# Altium schematic sheet SHIELD-uSD-MIKROE-PMOD.SchDoc
size A3; CheckedBy: José Ogando; Engineer: Eduardo Teofilo; Revision: A2; SheetNumber: 5; SheetTotal: 8
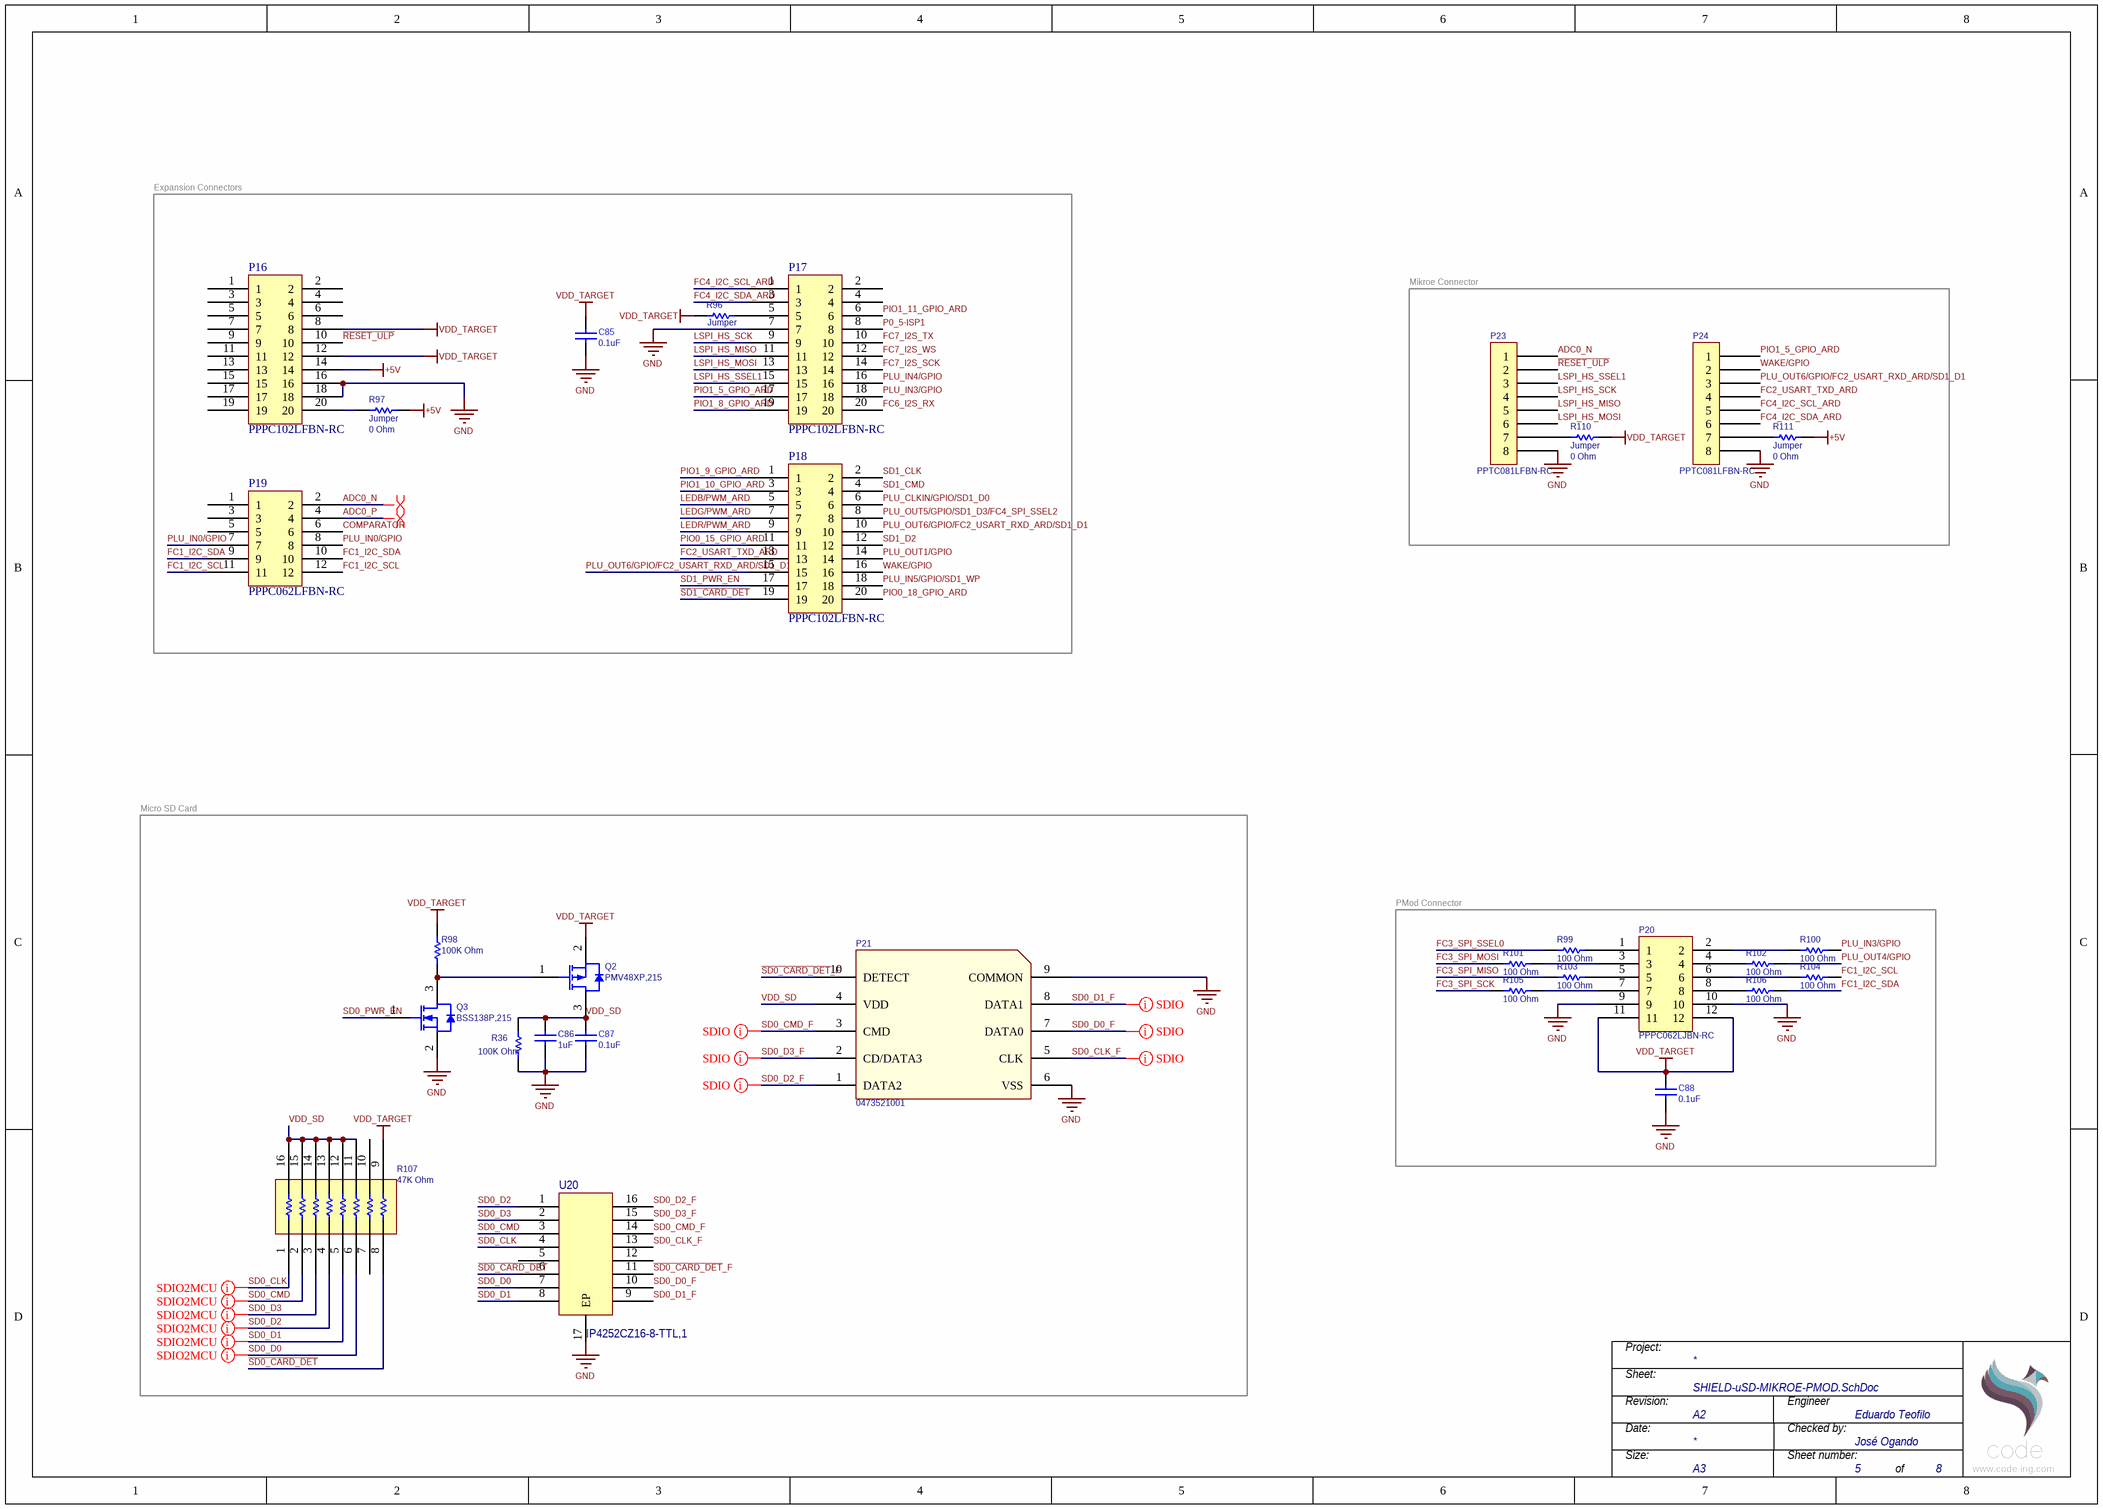
[diagram p0: SHIELD-uSD-MIKROE-PMOD.SchDoc]

## Parts
C85  value 0.1uF  [CAPC1005]  (hidden comment: CC0402KRX7R7BB104)
C86  value 1uF  [CAPC0402(1005)60_L]  (hidden comment: CAP 1uF 10V 0402(1005))
C87  value 0.1uF  [CAPC1005]  (hidden comment: CC0402KRX7R7BB104)
C88  value 0.1uF  [CAPC1005]  (hidden comment: CC0402KRX7R7BB104)
P16  PPPC102LFBN-RC  [PPPC102LFBN-RC]
P17  PPPC102LFBN-RC  [PPPC102LFBN-RC]
P18  PPPC102LFBN-RC  [PPPC102LFBN-RC]
P19  PPPC062LFBN-RC  [PPPC062LFBN-RC]
P20  PPPC062LJBN-RC  [PPPC062LJBN-RC]
P21  0473521001  [0473521001]
P23  PPTC081LFBN-RC  [Header 8x1]
P24  PPTC081LFBN-RC  [Header 8x1]
Q2  PMV48XP,215  [NXP-SOT23_M]
Q3  BSS138P,215  [NXP-SOT23_N]
R36  value 100K Ohm  [RESC1005X40X25LL05T05]  (hidden comment: ERJ-2RKF1003X)
R96  Jumper  [RESC0402(1005)_L]
R97  Jumper  value 0 Ohm  [RESC0402(1005)_L]
R98  value 100K Ohm  [RESC1005X40X25LL05T05]  (hidden comment: ERJ-2RKF1003X)
R99  value 100 Ohm  [RESC0402(1005)_L]  (hidden comment: 100R 5% 0402(1005))
R100  value 100 Ohm  [RESC0402(1005)_L]  (hidden comment: 100R 5% 0402(1005))
R101  value 100 Ohm  [RESC0402(1005)_L]  (hidden comment: 100R 5% 0402(1005))
R102  value 100 Ohm  [RESC0402(1005)_L]  (hidden comment: 100R 5% 0402(1005))
R103  value 100 Ohm  [RESC0402(1005)_L]  (hidden comment: 100R 5% 0402(1005))
R104  value 100 Ohm  [RESC0402(1005)_L]  (hidden comment: 100R 5% 0402(1005))
R105  value 100 Ohm  [RESC0402(1005)_L]  (hidden comment: 100R 5% 0402(1005))
R106  value 100 Ohm  [RESC0402(1005)_L]  (hidden comment: 100R 5% 0402(1005))
R107  value 47K Ohm  [EXB-2HV473JV]  (hidden comment: EXB-2HV473JV)
R110  Jumper  value 0 Ohm  [RESC0402(1005)_L]
R111  Jumper  value 0 Ohm  [RESC0402(1005)_L]
U20  IP4252CZ16-8-TTL,1  [HUSON16]

## Blocks framed on the sheet
Expansion Connectors: C85 P16-P19 R96 R97
Mikroe Connector: P23 P24 R110 R111
Micro SD Card: C86 C87 P21 Q2 Q3 R36 R98 R107 U20
PMod Connector: C88 P20 R99-R106

## Nets
+5V: P16.14 R97.1 R111.1
GND: C85.2 C86.1 C87.2 C88.2 P16.16 P16.18 P17.7 P20.9 P20.10 P21.6(VSS) P21.9(COMMON) P23.8 P24.8 Q3.2(S) R36.1 U20.17(EP)
VDD_TARGET: C85.1 C88.1 P16.8 P16.12 P20.11 P20.12 Q2.2(S) R96.2 R98.2 R107.9 R110.1
ADC0_N: P19.2 P23.1
ADC0_P: P19.4
COMPARATOR: P19.6
FC1_I2C_SCL: P19.11 P19.12 R104.2
FC1_I2C_SDA: P19.9 P19.10 R106.2
FC2_USART_TXD_ARD: P18.13 P24.4
FC3_SPI_MISO: R103.1
FC3_SPI_MOSI: R101.1
FC3_SPI_SCK: R105.1
FC3_SPI_SSEL0: R99.1
FC4_I2C_SCL_ARD: P17.1 P24.5
FC4_I2C_SDA_ARD: P17.3 P24.6
FC6_I2S_RX: P17.20
FC7_I2S_SCK: P17.14
FC7_I2S_TX: P17.10
FC7_I2S_WS: P17.12
LEDB/PWM_ARD: P18.5
LEDG/PWM_ARD: P18.7
LEDR/PWM_ARD: P18.9
LSPI_HS_MISO: P17.11 P23.5
LSPI_HS_MOSI: P17.13 P23.6
LSPI_HS_SCK: P17.9 P23.4
LSPI_HS_SSEL1: P17.15 P23.3
P0_5-ISP1: P17.8
PIO0_15_GPIO_ARD: P18.11
PIO0_18_GPIO_ARD: P18.20
PIO1_5_GPIO_ARD: P17.17 P24.1
PIO1_8_GPIO_ARD: P17.19
PIO1_9_GPIO_ARD: P18.1
PIO1_10_GPIO_ARD: P18.3
PIO1_11_GPIO_ARD: P17.6
PLU_CLKIN/GPIO/SD1_D0: P18.6
PLU_IN0/GPIO: P19.7 P19.8
PLU_IN3/GPIO: P17.18 R100.2
PLU_IN4/GPIO: P17.16
PLU_IN5/GPIO/SD1_WP: P18.18
PLU_OUT1/GPIO: P18.14
PLU_OUT4/GPIO: R102.2
PLU_OUT5/GPIO/SD1_D3/FC4_SPI_SSEL2: P18.8
PLU_OUT6/GPIO/FC2_USART_RXD_ARD/SD1_D1: P18.10 P18.15 P24.3
~{RESET_ULP}: P16.10 P23.2
~{SD0_CARD_DET}: R107.8 U20.6
~{SD0_CARD_DET}_F: P21.10(DETECT) U20.11
~{SD1_CARD_DET}: P18.19
SD0_CLK: R107.1 U20.4
SD0_CLK_F: P21.5(CLK) U20.13
SD0_CMD: R107.2 U20.3
SD0_CMD_F: P21.3(CMD) U20.14
SD0_D0: R107.6 U20.7
SD0_D0_F: P21.7(DATA0) U20.10
SD0_D1: R107.5 U20.8
SD0_D1_F: P21.8(DATA1) U20.9
SD0_D2: R107.4 U20.1
SD0_D2_F: P21.1(DATA2) U20.16
SD0_D3: R107.3 U20.2
SD0_D3_F: P21.2(CD/DATA3) U20.15
SD0_PWR_EN: Q3.1(G)
SD1_CLK: P18.2
SD1_CMD: P18.4
SD1_D2: P18.12
SD1_PWR_EN: P18.17
VDD_SD: C86.2 C87.1 P21.4(VDD) Q2.3(D) R36.2 R107.11 R107.12 R107.13 R107.14 R107.15 R107.16
WAKE/GPIO: P18.16 P24.2
NetP16_20: P16.20 R97.2
NetP17_5: P17.5 R96.1
NetP20_1: P20.1 R99.2
NetP20_2: P20.2 R100.1
NetP20_3: P20.3 R101.2
NetP20_4: P20.4 R102.1
NetP20_5: P20.5 R103.2
NetP20_6: P20.6 R104.1
NetP20_7: P20.7 R105.2
NetP20_8: P20.8 R106.1
NetP23_7: P23.7 R110.2
NetP24_7: P24.7 R111.2
NetQ2_1: Q2.1(G) Q3.3(D) R98.1

Not connected (* = marked no-connect by the designer): P16 1 2 3 4 5 6 7 9 11 13 15 17 19; P17 2 4; P19 1 3 5; R107 7 10; U20 5 12

## Layout directives
net class SDIO: SD0_CLK_F, SD0_CMD_F, SD0_D0_F, SD0_D1_F, SD0_D2_F, SD0_D3_F
net class SDIO2MCU: SD0_CLK, SD0_CMD, SD0_D0, SD0_D1, SD0_D2, SD0_D3
differential pair: ADC0_N, ADC0_P

## Notes on the sheet
- Project:
- Sheet:
- Revision:
- Date:
- Size:
- Sheet number:
- Engineer
- Checked by:
- A3
- of
- www.code-ing.com

## Library data of the parts
C85 C87 C88 = CMP-0001-00074-1: Capacitor, Yageo, Ceramic, 0.1uF 10% 16V 0402 (1005) X7R; Polarity: Non-Polarized; ClassName: Board Template Device; Rated Voltage: 16 V; Status: Production; Tolerance: 10 %; Mounting Technology: Surface Mount; Technology: Ceramic; Category: Capacitor; Dielectric: X7R; Publisher: Altium
C86 = CMP-1034-02118-1: CAP 1uF 10V -20% to +80% 0402 (1005 Metric) Thickness 0.6mm SMD; Case-EIA: 0402; Case-Metric: 1005; Tolerance: -20% to +80%; Max Thickness: 0.6 mm; Rated Voltage: 10 V; Technology: SMT
P16-P18 = PPPC102LFBN-RC: CONN HEADER FMAL 20PS.1" DL GOLD; Manufacturer: Sullins Connector Solutions; Manufacturer Part #: PPPC102LFBN-RC; Created by: jvelasquez; Creation date: 05-Apr-2018; Modified by: *; Indications: *; Value: *
P19 = PPPC062LFBN-RC: CONN HEADER FMAL 12PS.1" DL GOLD; Manufacturer: Sullins Connector Solutions; Manufacturer Part #: PPPC062LFBN-RC; Created by: jvelasquez; Creation date: 05-Apr-2018; Modified by: *; Indications: *; Value: *
P20 = PPPC062LJBN-RC: CONN FEMALE 12POSDL .1" R/A GOLD; Manufacturer: Sullins Connector Solutions; Manufacturer Part #: PPPC062LJBN-RC; Created by: eteofilo; Creation date: 17-Apr-2018; Modified by: *; Value: *
P21 = 0473521001: CONN MICRO SD CARD PUSH-PUSH R/A; Manufacturer: Molex Inc; Manufacturer part #: 0473521001; Indications: *; Created by: eteofilo; Creation date: 17-Apr-2018; Value: *; Modified by: *
P23 P24 = PPTC081LFBN-RC: CONN HEADER FEMALE 8POS .1" TIN; Manufacturer: Sullins Connector Solutions; Manufacturer Part #: PPTC081LFBN-RC; Created by: eteofilo; Creation Date: 10-May-2018; Modified by: *; Value: *; Indicattions: *
Q2 = CMP-1258-00160-1: P-Channel Trench MOSFET, -20 V, -3.5 A, -55 to 150 degC, 3-Pin SOT23, Tape and Reel; Manufacturer: NXP Semiconductors; VGSth [typ] (V): -1; Ciss [typ] (pF): 1000; Coss [typ] (pF): 130; Channel Type: P; Packing: Tape & Reel; PackageVersion: 06-03-16, 03/2006; ComponentLink3Description: Package Specification; Mounting Technology: Surface Mount; DatasheetVersion: Rev. 1; ComponentLink2Description: Datasheet; VDS [max] (V): -20; ComponentLink1URL: http://www.nxp.com/; ComponentLink3URL: http://www.nxp.com/documents/outline_drawing/sot023_po.pdf; ID [max] (A): -3.5; ComponentLink2URL: http://www.nxp.com/documents/data_sheet/PMV48XP.pdf; PackageDescription: 3-Pin Small Outline Transistor Package, Body 2.9 x 1.3 mm, Pitch 0.95 mm; ComponentLink1Description: Manufacturer URL; PackageReference: SOT23; PartNumber: PMV48XP,215; Code_JEDEC: TO-236AB
Q3 = CMP-1259-00085-1: N-Channel Trench MOSFET, 60 V, 0.36 A, -55 to 150 degC, 3-Pin SOT23, Tape and Reel; Manufacturer: NXP Semiconductors; IDM [max] (A): 1.2; Channel Type: N; VDS [max] (V): 60; Packing: Tape & Reel; Automotive Qualified: Y; ID [max] (A): 0.36; ComponentLink1URL: http://www.nxp.com/; ComponentLink1Description: Manufacturer URL; Code_JEDEC: TO-236AB; PackageReference: SOT23; PartNumber: BSS138P,215; ComponentLink2URL: http://www.nxp.com/documents/data_sheet/BSS138P.pdf; PackageDescription: 3-Pin Small Outline Transistor Package, Body 2.9 x 1.3 mm, Pitch 0.95 mm; VGSth [typ] (V): 1.2; DatasheetVersion: Rev. 1; Mounting Technology: Surface Mount; ComponentLink3URL: http://www.nxp.com/documents/outline_drawing/sot023_po.pdf; ComponentLink3Description: Package Specification; ComponentLink2Description: Datasheet; PackageVersion: 06-03-16, 03/2006
R36 = CMP-2002-00608-3: Chip Resistor, 100 KOhm, +/- 1%, 100 mW, -55 to 155 degC, 0402 (1005 Metric), RoHS, Tape and Reel; Manufacturer: Basic Passives; Power Rating: 100 mW; Voltage Rating: 50 V; Case\/Package: 0402; Indications: DNI; Case Code (Imperial): 0402; RoHSCompliant: true; Min Operating Temperature: -55 degC; Mount: Surface Mount; Packaging: Tape and Reel; PackageDescription: 2-Pin Surface Mount Device, Body 1 x 0.5 mm; Tolerance: 1%; REACH SVHC: Yes; ComponentLink1URL: http://www.panasonic.com/; ComponentLink1Description: Manufacturer URL; Package Quantity: 10000; Mounting Technology: Surface Mount; DatasheetVersion: 04/2015; PartNumber: ERJ-2RKF1003X; Height: 0.35 mm; Pins: 2; Length: 1 mm; Max Operating Temperature: 155 degC; ComponentLink2Description: Datasheet; ComponentLink2URL: http://industrial.panasonic.com/cdbs/www-data/pdf/RDA0000/AOA0000C86.pdf; PackageReference: 0402; Radiation Hardening: No; Width: 0.5 mm; Case Code (Metric): 1005
R96 = CMP-1011-00001-1: Jumper 0402 (1005 Metric); Tolerance: None; Case-Metric: 1005; Case-EIA: 0402; Value: 0 Ohm; Power: None; Technology: SMT
R97 R110 R111 = CMP-1011-00001-1: Jumper 0402 (1005 Metric); Tolerance: None; Case-Metric: 1005; Case-EIA: 0402; Power: None; Technology: SMT
R98 = CMP-2002-00608-3: Chip Resistor, 100 KOhm, +/- 1%, 100 mW, -55 to 155 degC, 0402 (1005 Metric), RoHS, Tape and Reel; Manufacturer: Basic Passives; Power Rating: 100 mW; Voltage Rating: 50 V; Case\/Package: 0402; Case Code (Imperial): 0402; RoHSCompliant: true; Min Operating Temperature: -55 degC; Mount: Surface Mount; Packaging: Tape and Reel; PackageDescription: 2-Pin Surface Mount Device, Body 1 x 0.5 mm; Tolerance: 1%; REACH SVHC: Yes; ComponentLink1URL: http://www.panasonic.com/; ComponentLink1Description: Manufacturer URL; Package Quantity: 10000; Mounting Technology: Surface Mount; DatasheetVersion: 04/2015; PartNumber: ERJ-2RKF1003X; Height: 0.35 mm; Pins: 2; Length: 1 mm; Max Operating Temperature: 155 degC; ComponentLink2Description: Datasheet; ComponentLink2URL: http://industrial.panasonic.com/cdbs/www-data/pdf/RDA0000/AOA0000C86.pdf; PackageReference: 0402; Radiation Hardening: No; Width: 0.5 mm; Case Code (Metric): 1005
R99-R106 = CMP-1011-00050-1: 100R 0.063W 5% 0402 (1005 Metric)  SMD; Case-Metric: 1005; Case-EIA: 0402; Power: 0.063 W; Technology: SMT; Tolerance: 5 %
R107 = EXB-2HV473JV: RES ARRAY 8 RES 47K OHM 1506; Manufacturer: Panasonic Electronic Components; Indications: *; Created by: eteofilo; Creation date: 17-Apr-2018; Manufacturer part #: EXB-2HV473JV; Modified by: *
U20 = IP4252CZ16-8-TTL,1: Manufacturer: Nexperia USA Inc.; Manufacturer Part #: IP4252CZ16-8-TTL,1; Created by: eteofilo; Creation Date: 17-Apr-2018; Modified by: *; Indications: *; Value: *